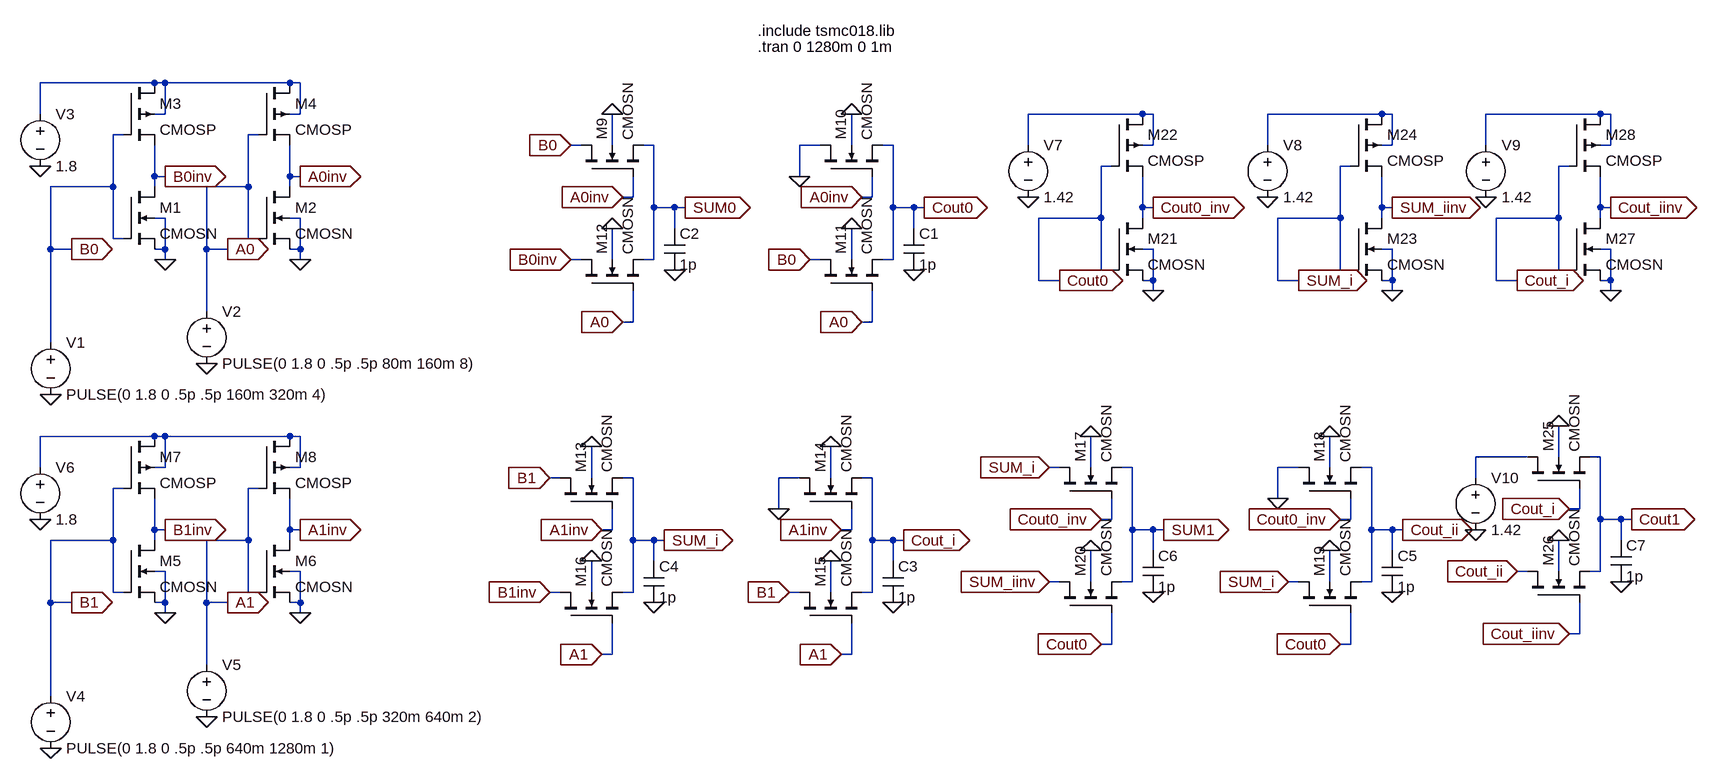
[diagram p0: schematic Half Adder.asc]
Half Adder.asc, the LTspice schematic file:
Version 4
SHEET 1 2008 980
WIRE -400 -64 -576 -64
WIRE -384 -64 -400 -64
WIRE -192 -64 -384 -64
WIRE -176 -64 -192 -64
WIRE -576 -16 -576 -64
WIRE -384 -16 -384 -64
WIRE -384 -16 -400 -16
WIRE -176 -16 -176 -64
WIRE -176 -16 -192 -16
WIRE 1120 -16 944 -16
WIRE 1136 -16 1120 -16
WIRE 1488 -16 1312 -16
WIRE 1504 -16 1488 -16
WIRE 1824 -16 1648 -16
WIRE 1840 -16 1824 -16
WIRE -448 16 -464 16
WIRE -240 16 -256 16
WIRE 256 32 240 32
WIRE 304 32 304 -16
WIRE 368 32 352 32
WIRE 624 32 592 32
WIRE 672 32 672 -16
WIRE 736 32 720 32
WIRE 944 32 944 -16
WIRE 1136 32 1136 -16
WIRE 1136 32 1120 32
WIRE 1312 32 1312 -16
WIRE 1504 32 1504 -16
WIRE 1504 32 1488 32
WIRE 1648 32 1648 -16
WIRE 1840 32 1840 -16
WIRE 1840 32 1824 32
WIRE 1072 64 1056 64
WIRE 1440 64 1424 64
WIRE 1776 64 1760 64
WIRE -400 80 -400 32
WIRE -384 80 -400 80
WIRE -192 80 -192 32
WIRE -176 80 -192 80
WIRE 592 80 592 32
WIRE -464 96 -464 16
WIRE -464 96 -560 96
WIRE -400 96 -400 80
WIRE -256 96 -256 16
WIRE -256 96 -320 96
WIRE -192 96 -192 80
WIRE 336 112 336 80
WIRE 336 112 320 112
WIRE 704 112 704 80
WIRE 704 112 688 112
WIRE 368 128 368 32
WIRE 400 128 368 128
WIRE 416 128 400 128
WIRE 736 128 736 32
WIRE 768 128 736 128
WIRE 784 128 768 128
WIRE 1120 128 1120 80
WIRE 1136 128 1120 128
WIRE 1488 128 1488 80
WIRE 1504 128 1488 128
WIRE 1824 128 1824 80
WIRE 1840 128 1824 128
WIRE -384 144 -400 144
WIRE -176 144 -192 144
WIRE 1056 144 1056 64
WIRE 1056 144 960 144
WIRE 1120 144 1120 128
WIRE 1424 144 1424 64
WIRE 1424 144 1328 144
WIRE 1488 144 1488 128
WIRE 1760 144 1760 64
WIRE 1760 144 1664 144
WIRE 1824 144 1824 128
WIRE 400 160 400 128
WIRE 768 160 768 128
WIRE -464 176 -464 96
WIRE -448 176 -464 176
WIRE -256 176 -256 96
WIRE -240 176 -256 176
WIRE -560 192 -560 96
WIRE -528 192 -560 192
WIRE -384 192 -384 144
WIRE -384 192 -400 192
WIRE -320 192 -320 96
WIRE -288 192 -320 192
WIRE -176 192 -176 144
WIRE -176 192 -192 192
WIRE 1136 192 1120 192
WIRE 1504 192 1488 192
WIRE 1840 192 1824 192
WIRE -384 208 -384 192
WIRE -176 208 -176 192
WIRE 256 208 240 208
WIRE 304 208 304 160
WIRE 368 208 368 128
WIRE 368 208 352 208
WIRE 624 208 608 208
WIRE 672 208 672 160
WIRE 736 208 736 128
WIRE 736 208 720 208
WIRE 1056 224 1056 144
WIRE 1072 224 1056 224
WIRE 1424 224 1424 144
WIRE 1440 224 1424 224
WIRE 1760 224 1760 144
WIRE 1776 224 1760 224
WIRE 960 240 960 144
WIRE 992 240 960 240
WIRE 1136 240 1136 192
WIRE 1136 240 1120 240
WIRE 1328 240 1328 144
WIRE 1360 240 1328 240
WIRE 1504 240 1504 192
WIRE 1504 240 1488 240
WIRE 1664 240 1664 144
WIRE 1696 240 1664 240
WIRE 1840 240 1840 192
WIRE 1840 240 1824 240
WIRE 1136 256 1136 240
WIRE 1504 256 1504 240
WIRE 1840 256 1840 240
WIRE -320 288 -320 192
WIRE 336 304 336 256
WIRE 336 304 320 304
WIRE 704 304 704 256
WIRE 704 304 688 304
WIRE -560 336 -560 192
WIRE -400 480 -576 480
WIRE -384 480 -400 480
WIRE -192 480 -384 480
WIRE -176 480 -192 480
WIRE 1712 512 1632 512
WIRE 1760 512 1760 464
WIRE 1824 512 1808 512
WIRE -576 528 -576 480
WIRE -384 528 -384 480
WIRE -384 528 -400 528
WIRE -176 528 -176 480
WIRE -176 528 -192 528
WIRE 992 528 976 528
WIRE 1040 528 1040 480
WIRE 1104 528 1088 528
WIRE 1360 528 1328 528
WIRE 1408 528 1408 480
WIRE 1472 528 1456 528
WIRE 224 544 208 544
WIRE 272 544 272 496
WIRE 336 544 320 544
WIRE 592 544 560 544
WIRE 640 544 640 496
WIRE 704 544 688 544
WIRE 1632 544 1632 512
WIRE -448 560 -464 560
WIRE -240 560 -256 560
WIRE 1328 576 1328 528
WIRE 560 592 560 544
WIRE 1792 592 1792 560
WIRE 1792 592 1776 592
WIRE 1072 608 1072 576
WIRE 1072 608 1056 608
WIRE 1440 608 1440 576
WIRE 1440 608 1424 608
WIRE 1824 608 1824 512
WIRE 1856 608 1824 608
WIRE 1872 608 1856 608
WIRE -400 624 -400 576
WIRE -384 624 -400 624
WIRE -192 624 -192 576
WIRE -176 624 -192 624
WIRE 304 624 304 592
WIRE 304 624 288 624
WIRE 672 624 672 592
WIRE 672 624 656 624
WIRE 1104 624 1104 528
WIRE 1136 624 1104 624
WIRE 1152 624 1136 624
WIRE 1472 624 1472 528
WIRE 1504 624 1472 624
WIRE 1520 624 1504 624
WIRE -464 640 -464 560
WIRE -464 640 -560 640
WIRE -400 640 -400 624
WIRE -256 640 -256 560
WIRE -256 640 -320 640
WIRE -192 640 -192 624
WIRE 336 640 336 544
WIRE 368 640 336 640
WIRE 384 640 368 640
WIRE 704 640 704 544
WIRE 736 640 704 640
WIRE 752 640 736 640
WIRE 1856 640 1856 608
WIRE 1136 656 1136 624
WIRE 1504 656 1504 624
WIRE 368 672 368 640
WIRE 736 672 736 640
WIRE -384 688 -400 688
WIRE -176 688 -192 688
WIRE 1712 688 1696 688
WIRE 1760 688 1760 640
WIRE 1824 688 1824 608
WIRE 1824 688 1808 688
WIRE 992 704 976 704
WIRE 1040 704 1040 656
WIRE 1104 704 1104 624
WIRE 1104 704 1088 704
WIRE 1360 704 1344 704
WIRE 1408 704 1408 656
WIRE 1472 704 1472 624
WIRE 1472 704 1456 704
WIRE -464 720 -464 640
WIRE -448 720 -464 720
WIRE -256 720 -256 640
WIRE -240 720 -256 720
WIRE 224 720 208 720
WIRE 272 720 272 672
WIRE 336 720 336 640
WIRE 336 720 320 720
WIRE 592 720 576 720
WIRE 640 720 640 672
WIRE 704 720 704 640
WIRE 704 720 688 720
WIRE -560 736 -560 640
WIRE -528 736 -560 736
WIRE -384 736 -384 688
WIRE -384 736 -400 736
WIRE -320 736 -320 640
WIRE -288 736 -320 736
WIRE -176 736 -176 688
WIRE -176 736 -192 736
WIRE -384 752 -384 736
WIRE -176 752 -176 736
WIRE 1792 784 1792 736
WIRE 1792 784 1776 784
WIRE 1072 800 1072 752
WIRE 1072 800 1056 800
WIRE 1440 800 1440 752
WIRE 1440 800 1424 800
WIRE 304 816 304 768
WIRE 304 816 288 816
WIRE 672 816 672 768
WIRE 672 816 656 816
WIRE -320 832 -320 736
WIRE -560 880 -560 736
FLAG -528 192 B0
IOPIN -528 192 Out
FLAG -288 192 A0
IOPIN -288 192 Out
FLAG -176 80 A0inv
IOPIN -176 80 Out
FLAG -384 80 B0inv
IOPIN -384 80 Out
FLAG -576 64 0
FLAG -384 208 0
FLAG -176 208 0
FLAG -320 368 0
FLAG -560 416 0
FLAG -528 736 B1
IOPIN -528 736 Out
FLAG -288 736 A1
IOPIN -288 736 Out
FLAG -176 624 A1inv
IOPIN -176 624 Out
FLAG -384 624 B1inv
IOPIN -384 624 Out
FLAG -576 608 0
FLAG -384 752 0
FLAG -176 752 0
FLAG -320 912 0
FLAG -560 960 0
FLAG 304 -16 0
FLAG 672 -16 0
FLAG 672 160 0
FLAG 304 160 0
FLAG 592 80 0
FLAG 400 224 0
FLAG 768 224 0
FLAG 320 304 A0
IOPIN 320 304 In
FLAG 688 304 A0
IOPIN 688 304 In
FLAG 320 112 A0inv
IOPIN 320 112 In
FLAG 688 112 A0inv
IOPIN 688 112 In
FLAG 608 208 B0
IOPIN 608 208 In
FLAG 240 32 B0
IOPIN 240 32 In
FLAG 240 208 B0inv
IOPIN 240 208 In
FLAG 416 128 SUM0
IOPIN 416 128 Out
FLAG 784 128 Cout0
IOPIN 784 128 Out
FLAG 272 496 0
FLAG 640 496 0
FLAG 640 672 0
FLAG 272 672 0
FLAG 560 592 0
FLAG 368 736 0
FLAG 736 736 0
FLAG 288 816 A1
IOPIN 288 816 In
FLAG 656 816 A1
IOPIN 656 816 In
FLAG 288 624 A1inv
IOPIN 288 624 In
FLAG 656 624 A1inv
IOPIN 656 624 In
FLAG 576 720 B1
IOPIN 576 720 In
FLAG 208 544 B1
IOPIN 208 544 In
FLAG 208 720 B1inv
IOPIN 208 720 In
FLAG 384 640 SUM_i
IOPIN 384 640 Out
FLAG 752 640 Cout_i
IOPIN 752 640 Out
FLAG 1040 480 0
FLAG 1408 480 0
FLAG 1408 656 0
FLAG 1040 656 0
FLAG 1328 576 0
FLAG 1136 720 0
FLAG 1504 720 0
FLAG 1056 800 Cout0
IOPIN 1056 800 In
FLAG 1424 800 Cout0
IOPIN 1424 800 In
FLAG 1056 608 Cout0_inv
IOPIN 1056 608 In
FLAG 1424 608 Cout0_inv
IOPIN 1424 608 In
FLAG 1344 704 SUM_i
IOPIN 1344 704 In
FLAG 976 528 SUM_i
IOPIN 976 528 In
FLAG 976 704 SUM_iinv
IOPIN 976 704 In
FLAG 1152 624 SUM1
IOPIN 1152 624 Out
FLAG 1520 624 Cout_ii
IOPIN 1520 624 Out
FLAG 992 240 Cout0
IOPIN 992 240 Out
FLAG 1136 128 Cout0_inv
IOPIN 1136 128 Out
FLAG 944 112 0
FLAG 1136 256 0
FLAG 1360 240 SUM_i
IOPIN 1360 240 Out
FLAG 1504 128 SUM_iinv
IOPIN 1504 128 Out
FLAG 1312 112 0
FLAG 1504 256 0
FLAG 1760 464 0
FLAG 1760 640 0
FLAG 1856 704 0
FLAG 1776 784 Cout_iinv
IOPIN 1776 784 In
FLAG 1776 592 Cout_i
IOPIN 1776 592 In
FLAG 1696 688 Cout_ii
IOPIN 1696 688 In
FLAG 1872 608 Cout1
IOPIN 1872 608 Out
FLAG 1696 240 Cout_i
IOPIN 1696 240 Out
FLAG 1840 128 Cout_iinv
IOPIN 1840 128 Out
FLAG 1648 112 0
FLAG 1840 256 0
FLAG 1632 624 0
SYMBOL voltage -560 320 R0
WINDOW 123 0 0 Left 0
WINDOW 39 0 0 Left 0
SYMATTR InstName V1
SYMATTR Value PULSE(0 1.8 0 .5p .5p 160m 320m 4)
SYMBOL voltage -320 272 R0
WINDOW 123 0 0 Left 0
WINDOW 39 0 0 Left 0
SYMATTR InstName V2
SYMATTR Value PULSE(0 1.8 0 .5p .5p 80m 160m 8)
SYMBOL cmosn -448 96 R0
SYMATTR InstName M1
SYMATTR Value2 l=180n w=1u
SYMBOL cmosn -240 96 R0
SYMATTR InstName M2
SYMATTR Value2 l=180n w=1u
SYMBOL cmosp -448 -64 R0
SYMATTR InstName M3
SYMATTR Value2 l=180n w=2u
SYMBOL cmosp -240 -64 R0
SYMATTR InstName M4
SYMATTR Value2 l=180n w=2u
SYMBOL voltage -576 -32 R0
WINDOW 123 0 0 Left 0
WINDOW 39 0 0 Left 0
SYMATTR InstName V3
SYMATTR Value 1.8
SYMBOL voltage -560 864 R0
WINDOW 123 0 0 Left 0
WINDOW 39 0 0 Left 0
SYMATTR InstName V4
SYMATTR Value PULSE(0 1.8 0 .5p .5p 640m 1280m 1)
SYMBOL voltage -320 816 R0
WINDOW 123 0 0 Left 0
WINDOW 39 0 0 Left 0
SYMATTR InstName V5
SYMATTR Value PULSE(0 1.8 0 .5p .5p 320m 640m 2)
SYMBOL cmosn -448 640 R0
SYMATTR InstName M5
SYMATTR Value2 l=180n w=1u
SYMBOL cmosn -240 640 R0
SYMATTR InstName M6
SYMATTR Value2 l=180n w=1u
SYMBOL cmosp -448 480 R0
SYMATTR InstName M7
SYMATTR Value2 l=180n w=2u
SYMBOL cmosp -240 480 R0
SYMATTR InstName M8
SYMATTR Value2 l=180n w=2u
SYMBOL voltage -576 512 R0
WINDOW 123 0 0 Left 0
WINDOW 39 0 0 Left 0
SYMATTR InstName V6
SYMATTR Value 1.8
SYMBOL cmosn 256 80 R270
SYMATTR InstName M9
SYMATTR Value2 l=180n w=1u
SYMBOL cmosn 624 80 R270
SYMATTR InstName M10
SYMATTR Value2 l=180n w=1u
SYMBOL cmosn 624 256 R270
SYMATTR InstName M11
SYMATTR Value2 l=180n w=1u
SYMBOL cmosn 256 256 R270
SYMATTR InstName M12
SYMATTR Value2 l=180n w=1u
SYMBOL cap 752 160 R0
SYMATTR InstName C1
SYMATTR Value 1p
SYMBOL cap 384 160 R0
SYMATTR InstName C2
SYMATTR Value 1p
SYMBOL cmosn 224 592 R270
SYMATTR InstName M13
SYMATTR Value2 l=180n w=1u
SYMBOL cmosn 592 592 R270
SYMATTR InstName M14
SYMATTR Value2 l=180n w=1u
SYMBOL cmosn 592 768 R270
SYMATTR InstName M15
SYMATTR Value2 l=180n w=1u
SYMBOL cmosn 224 768 R270
SYMATTR InstName M16
SYMATTR Value2 l=180n w=1u
SYMBOL cap 720 672 R0
SYMATTR InstName C3
SYMATTR Value 1p
SYMBOL cap 352 672 R0
SYMATTR InstName C4
SYMATTR Value 1p
SYMBOL cmosn 992 576 R270
SYMATTR InstName M17
SYMATTR Value2 l=180n w=1u
SYMBOL cmosn 1360 576 R270
SYMATTR InstName M18
SYMATTR Value2 l=180n w=1u
SYMBOL cmosn 1360 752 R270
SYMATTR InstName M19
SYMATTR Value2 l=180n w=1u
SYMBOL cmosn 992 752 R270
SYMATTR InstName M20
SYMATTR Value2 l=180n w=1u
SYMBOL cap 1488 656 R0
SYMATTR InstName C5
SYMATTR Value 1p
SYMBOL cap 1120 656 R0
SYMATTR InstName C6
SYMATTR Value 1p
SYMBOL cmosn 1072 144 R0
SYMATTR InstName M21
SYMATTR Value2 l=180n w=1u
SYMBOL cmosp 1072 -16 R0
SYMATTR InstName M22
SYMATTR Value2 l=180n w=2u
SYMBOL voltage 944 16 R0
WINDOW 123 0 0 Left 0
WINDOW 39 0 0 Left 0
SYMATTR InstName V7
SYMATTR Value 1.42
SYMBOL cmosn 1440 144 R0
SYMATTR InstName M23
SYMATTR Value2 l=180n w=1u
SYMBOL cmosp 1440 -16 R0
SYMATTR InstName M24
SYMATTR Value2 l=180n w=2u
SYMBOL voltage 1312 16 R0
WINDOW 123 0 0 Left 0
WINDOW 39 0 0 Left 0
SYMATTR InstName V8
SYMATTR Value 1.42
SYMBOL cmosn 1712 560 R270
SYMATTR InstName M25
SYMATTR Value2 l=180n w=1u
SYMBOL cmosn 1712 736 R270
SYMATTR InstName M26
SYMATTR Value2 l=180n w=1u
SYMBOL cap 1840 640 R0
SYMATTR InstName C7
SYMATTR Value 1p
SYMBOL cmosn 1776 144 R0
SYMATTR InstName M27
SYMATTR Value2 l=180n w=1u
SYMBOL cmosp 1776 -16 R0
SYMATTR InstName M28
SYMATTR Value2 l=180n w=2u
SYMBOL voltage 1648 16 R0
WINDOW 123 0 0 Left 0
WINDOW 39 0 0 Left 0
SYMATTR InstName V9
SYMATTR Value 1.42
SYMBOL voltage 1632 528 R0
SYMATTR InstName V10
SYMATTR Value 1.42
TEXT 528 -144 Left 2 !.include tsmc018.lib
TEXT 528 -120 Left 2 !.tran 0 1280m 0 1m

The netlist it stands for:
* Half Adder.asc
V1 B0 0 PULSE(0 1.8 0 .5p .5p 160m 320m 4)
V2 A0 0 PULSE(0 1.8 0 .5p .5p 80m 160m 8)
M1 B0inv B0 0 0 CMOSN l=180n w=1u
M2 A0inv A0 0 0 CMOSN l=180n w=1u
M3 N001 B0 B0inv N001 CMOSP l=180n w=2u
M4 N001 A0 A0inv N001 CMOSP l=180n w=2u
V3 N001 0 1.8
V4 B1 0 PULSE(0 1.8 0 .5p .5p 640m 1280m 1)
V5 A1 0 PULSE(0 1.8 0 .5p .5p 320m 640m 2)
M5 B1inv B1 0 0 CMOSN l=180n w=1u
M6 A1inv A1 0 0 CMOSN l=180n w=1u
M7 N005 B1 B1inv N005 CMOSP l=180n w=2u
M8 N005 A1 A1inv N005 CMOSP l=180n w=2u
V6 N005 0 1.8
M9 B0 A0inv SUM0 0 CMOSN l=180n w=1u
M10 0 A0inv Cout0 0 CMOSN l=180n w=1u
M11 B0 A0 Cout0 0 CMOSN l=180n w=1u
M12 B0inv A0 SUM0 0 CMOSN l=180n w=1u
C1 Cout0 0 1p
C2 SUM0 0 1p
M13 B1 A1inv SUM_i 0 CMOSN l=180n w=1u
M14 0 A1inv Cout_i 0 CMOSN l=180n w=1u
M15 B1 A1 Cout_i 0 CMOSN l=180n w=1u
M16 B1inv A1 SUM_i 0 CMOSN l=180n w=1u
C3 Cout_i 0 1p
C4 SUM_i 0 1p
M17 SUM_i Cout0_inv SUM1 0 CMOSN l=180n w=1u
M18 0 Cout0_inv Cout_ii 0 CMOSN l=180n w=1u
M19 SUM_i Cout0 Cout_ii 0 CMOSN l=180n w=1u
M20 SUM_iinv Cout0 SUM1 0 CMOSN l=180n w=1u
C5 Cout_ii 0 1p
C6 SUM1 0 1p
M21 Cout0_inv Cout0 0 0 CMOSN l=180n w=1u
M22 N002 Cout0 Cout0_inv N002 CMOSP l=180n w=2u
V7 N002 0 1.42
M23 SUM_iinv SUM_i 0 0 CMOSN l=180n w=1u
M24 N003 SUM_i SUM_iinv N003 CMOSP l=180n w=2u
V8 N003 0 1.42
M25 N006 Cout_i Cout1 0 CMOSN l=180n w=1u
M26 Cout_ii Cout_iinv Cout1 0 CMOSN l=180n w=1u
C7 Cout1 0 1p
M27 Cout_iinv Cout_i 0 0 CMOSN l=180n w=1u
M28 N004 Cout_i Cout_iinv N004 CMOSP l=180n w=2u
V9 N004 0 1.42
V10 N006 0 1.42
.model NMOS NMOS
.model PMOS PMOS
.lib standard.mos
.include tsmc018.lib
.tran 0 1280m 0 1m
.backanno
.end